# Altium schematic sheet MARS_FTDI.SchDoc: My title
size A3; Organization: University of California; Address1: 475 Portola Plaza; Address2: Los Angeles, CA 90095; Revision: R01; SheetNumber: 1; SheetTotal: 1
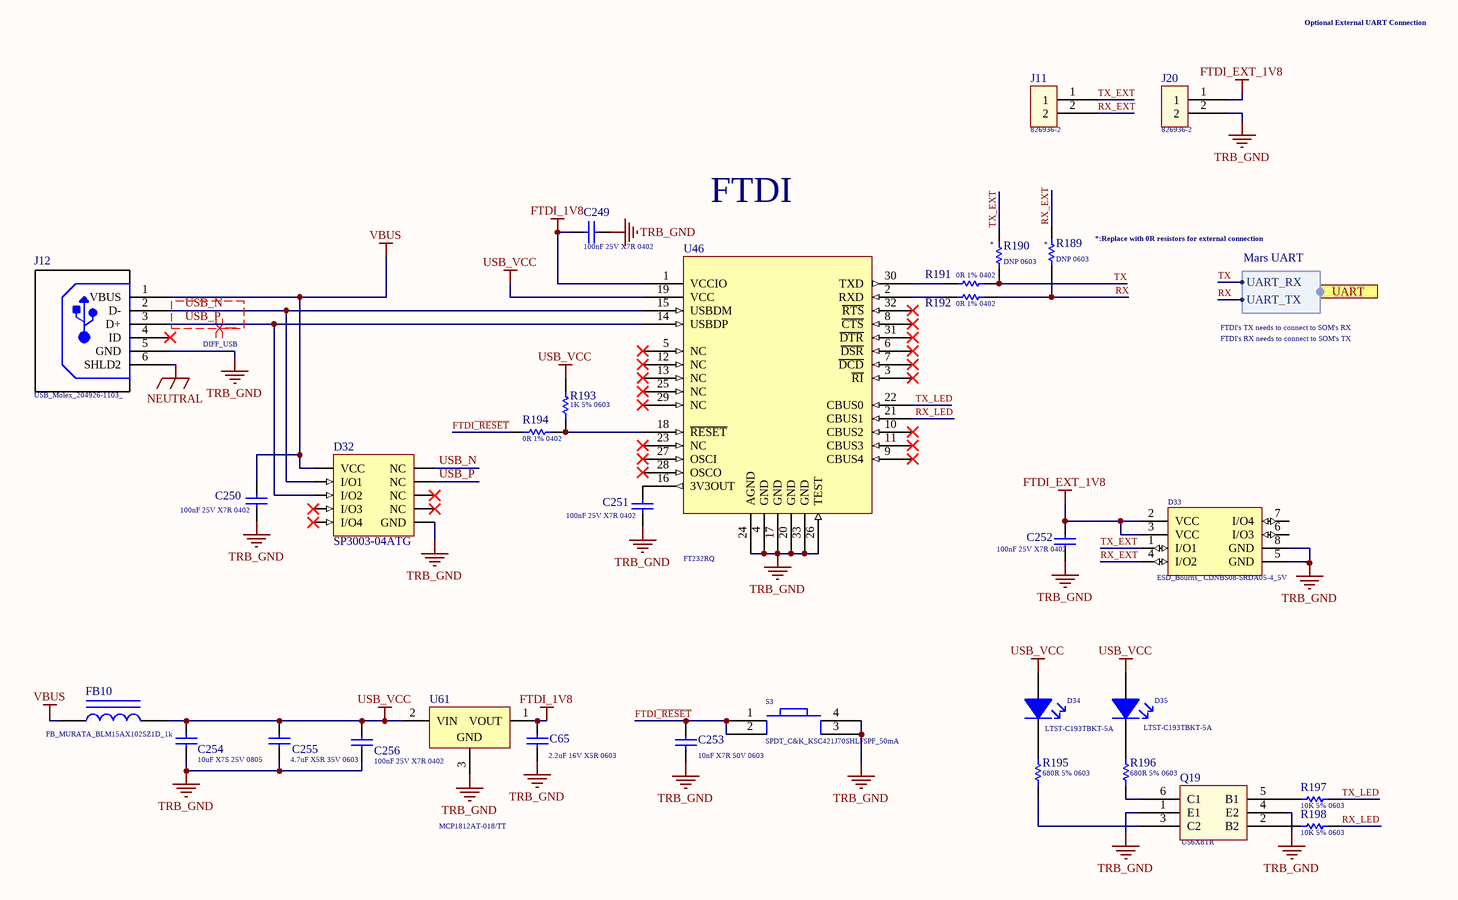
[diagram p0: MARS_FTDI.SchDoc]

## Parts
C65  Capacitance: 2.2uF 16V X5R 0603  [CAPC0603(1608)100_L]  (hidden comment: Cap_Taiyo_Yuden_2.2uF)
C249  Capacitance: 100nF 25V X7R 0402  [Cap_Taiyo_Yuden_TMK105B7104KV-FR_100nF]  (hidden comment: Cap_Taiyo_Yuden_TMK105B7104KV-FR_100nF)
C250  Capacitance: 100nF 25V X7R 0402  [Cap_Taiyo_Yuden_TMK105B7104KV-FR_100nF]  (hidden comment: Cap_Taiyo_Yuden_TMK105B7104KV-FR_100nF)
C251  Capacitance: 100nF 25V X7R 0402  [Cap_Taiyo_Yuden_TMK105B7104KV-FR_100nF]  (hidden comment: Cap_Taiyo_Yuden_TMK105B7104KV-FR_100nF)
C252  Capacitance: 100nF 25V X7R 0402  [Cap_Taiyo_Yuden_TMK105B7104KV-FR_100nF]  (hidden comment: Cap_Taiyo_Yuden_TMK105B7104KV-FR_100nF)
C253  Capacitance: 10nF X7R 50V 0603  [Kemet_C0603_0]  (hidden comment: Cap_Kemet_C0603C103J5RACTU_eec)
C254  Capacitance: 10uF X7S 25V 0805  [Cap_Murata_ GRM21BC71E106ME11L_10uF]  (hidden comment: Cap_Murata_ GRM21BC71E106ME11L_10uF)
C255  Capacitance: 4.7uF X5R 35V 0603  [Cap_Murata_ZRB18AR6YA475ME05L_4.7uF]  (hidden comment: Cap_Murata_ZRB18AR6YA475ME05L_4.7uF)
C256  Capacitance: 100nF 25V X7R 0402  [Cap_Taiyo_Yuden_TMK105B7104KV-FR_100nF]  (hidden comment: Cap_Taiyo_Yuden_TMK105B7104KV-FR_100nF)
D32  Series: SP3003-04ATG  [Diode_SP3003-04ATG_LVDS_ESD]  (hidden comment: Diode_SP3003-04ATG_LVDS_ESD)
D33  ESD_Bourns_ CDNBS08-SRDA05-4_5V  [ESD_Bourns_ CDNBS08-SRDA05-4_5V]
D34  Series: LTST-C193TBKT-5A  [Led_Lite-On_LTST-C193TBKT-5A_Blue]  (hidden comment: Led_Lite-On_LTST-C193TBKT-5A_Blue)
D35  Series: LTST-C193TBKT-5A  [Led_Lite-On_LTST-C193TBKT-5A_Blue]  (hidden comment: Led_Lite-On_LTST-C193TBKT-5A_Blue)
FB10  FB_MURATA_BLM15AX102SZ1D_1k  [FB_MURATA_BLM15AX102SZ1D_1k]
J11  Series: 826936-2  [Header_TE_Connectivity_826936-2_2POS_5A]  (hidden comment: Header_TE_Connectivity_826936-2_2POS_5A)
J12  USB_Molex_204926-1103_  [USB_Molex_204926-1103]
J20  Series: 826936-2  [Header_TE_Connectivity_826936-2_2POS_5A]  (hidden comment: Header_TE_Connectivity_826936-2_2POS_5A)
Q19  Series: US6X8TR  [BJT_ROHM_US6X8TR_1A_NPN]  (hidden comment: BJT_ROHM_US6X8TR_1A_NPN)
R189  Resistance: DNP 0603  [RES_DNP_0603]  (hidden comment: RES_DNP_0603)
R190  Resistance: DNP 0603  [RES_DNP_0603]  (hidden comment: RES_DNP_0603)
R191  Resistance: 0R 1% 0402  [Res_Vishay_CRCW04020000Z0EDC_0_Ohm]  (hidden comment: Res_Vishay_CRCW04020000Z0EDC_0_Ohm)
R192  Resistance: 0R 1% 0402  [Res_Vishay_CRCW04020000Z0EDC_0_Ohm]  (hidden comment: Res_Vishay_CRCW04020000Z0EDC_0_Ohm)
R193  1K 5% 0603  [RESC0603(1608)_L]
R194  Resistance: 0R 1% 0402  [Res_Vishay_CRCW04020000Z0EDC_0_Ohm]  (hidden comment: Res_Vishay_CRCW04020000Z0EDC_0_Ohm)
R195  680R 5% 0603  [RESC0603(1608)_L]
R196  680R 5% 0603  [RESC0603(1608)_L]
R197  10K 5% 0603  [RESC0603(1608)_L]
R198  10K 5% 0603  [RESC0603(1608)_L]
S3  SPDT_C&K_KSC421J70SHLFSPF_50mA  [SPDT_C&K_KSC421J70SHLFSPF_50mA]
U46  Series: FT232RQ  [IC_FTDI_FT232RQ-REEL]  (hidden comment: IC_FTDI_FT232RQ-REEL)
U61  Series: MCP1812AT-018/TT  [LDO_Microchip_MCP1812AT-018_1V8]  (hidden comment: LDO_Microchip_MCP1812AT-018_1V8)

## Ports
UART (harness Mars UART)

## Harnesses
Mars UART: UART_RX, UART_TX

## Nets
FTDI_1V8: C65.2 C249.2 U46.1(VCCIO) U61.1(VOUT)
FTDI_EXT_1V8: C252.2 D33.2(VCC) D33.3(VCC) J20.1
NEUTRAL: J12.6(SHLD2)
TRB_GND: C65.1 C249.1 C250.1 C251.1 C252.1 C253.2 C254.2 C255.1 C256.1 D32.8(GND) D33.5(GND) D33.8(GND) J12.5(GND) J20.2 Q19.1(E1) Q19.4(E2) S3.3 S3.4 U46.4(GND) U46.17(GND) U46.20(GND) U46.24(AGND) U46.26(TEST) U46.33(GND) U61.3(GND)
USB_VCC: C254.1 C255.2 C256.2 D34.2(A) D35.2(A) FB10.2 R193.2 U46.19(VCC) U61.2(VIN)
VBUS: C250.2 D32.3(VCC) FB10.1 J12.1(VBUS)
FTDI~{_RESET}: C253.1 R194.2 S3.1 S3.2
RX: R189.2 R192.2 ; port UART.UART_TX
RX_EXT: D33.4(I/O2) J11.2 R189.1
RX_LED: R198.1 U46.21(CBUS1)
TX: R190.2 R191.2 ; port UART.UART_RX
TX_EXT: D33.1(I/O1) J11.1 R190.1
TX_LED: R197.2 U46.22(CBUS0)
USB_N: D32.1(I/O1) D32.10(NC) J12.2(D-) U46.15(USBDM)
USB_P: D32.2(I/O2) D32.9(NC) J12.3(D+) U46.14(USBDP)
NetC251_2: C251.2 U46.16(3V3OUT)
NetD34_1: D34.1(K) R195.2
NetD35_1: D35.1(K) R196.2
NetQ19_2: Q19.2(B2) R198.2
NetQ19_3: Q19.3(C2) R195.1
NetQ19_5: Q19.5(B1) R197.1
NetQ19_6: Q19.6(C1) R196.1
NetR191_1: R191.1 U46.30(TXD)
NetR192_1: R192.1 U46.2(RXD)
NetR193_1: R193.1 R194.1 U46.18(~{RESET})

Not connected (* = marked no-connect by the designer): D32 4(I/O3)* 5(I/O4)* 6(NC)* 7(NC)*; D33 6(I/O3) 7(I/O4); J12 4(ID)*; U46 3(~{RI})* 5(NC)* 6(~{DSR})* 7(~{DCD})* 8(~{CTS})* 9(CBUS4)* 10(CBUS2)* 11(CBUS3)* 12(NC)* 13(NC)* 23(NC)* 25(NC)* 27(OSCI)* 28(OSCO)* 29(NC)* 31(~{DTR})* 32(~{RTS})*

## Layout directives
differential pair; differential pair class DIFF_USB: USB_N, USB_P

## Notes on the sheet
- Optional External UART Connection
- FTDI
- (near R190) *
- (near R189) *
- (near R189) *:Replace with 0R resistors for external connection
- FTDI's TX needs to connect to SOM's RX
- FTDI's RX needs to connect to SOM's TX
- 475 Portola Plaza
- GAPS TOF
- igarcia91@g.ucla.edu
- Los Angeles, CA
- 310-825-0344
- Size:
- Date:
- Letter
- Number:
- Time:
- Sheet
- Revision:
- of
- andrew.peck@cern.ch
- spq@ucla.edu
- File:

## Library data of the parts
C65 = CMP-1035-02763-1: CAP 2.2uF 16V ±10% 0603 (1608 Metric) Thickness 1mm SMD; Case-Metric: 1608; Case-EIA: 0603; Tolerance: Â±10%; Value: 2.2uF; Max Thickness: 1 mm; Technology: SMT; Rated Voltage: 16 V; Parameter 1: *
C249-C252 C256 = Cap_Taiyo_Yuden_TMK105B7104KV-FR_100nF: CAP CER 100nF 25V X7R 0402; Supplier 1: Mouser; Supplier Part Number 1: 963-TMK105B7104KV-FR
C253 = Cap_Kemet_C0603C103J5RACTU_eec: CAP CER 10nF 50V X7R 0603; Manufacturer: Kemet; Mfg Package Ident: C0603; Part Number: C0603C103J5RACTU; helpURL: https://upverter.com/upn/revision/8a8d0c297e33ac74/; ComponentLink2Description: Datasheet; Temperature: -55°C to +125°C; Package: C0603; Supplier 2: Mouser; Price: 0.0184203126773; Supplier 1: Digi-Key; ComponentLink1URL: https://upverter.com/upn/revision/8a8d0c297e33ac74/; Supplier Part Number 2: 80-C0603C103J5R; Supplier Part Number 1: 399-1092-1-ND; Value: 10nF; ComponentLink1Description: Upverter; ComponentLink2URL: https://content.kemet.com/datasheets/KEM_C1002_X7R_SMD.pdf; RoHS: TRUE; Mouser Part Number: 80-C0603C103J5R; Temperature Range High: +125°C; Digikey Description: CAP CER 10000PF 50V X7R 0603; Digikey Part Number: 399-1092-1-ND; Lead Free: yes; Temperature Range Low: -55°C; Voltage: 50V
C254 = Cap_Murata_ GRM21BC71E106ME11L_10uF: CAP CER 10uF 25V X7R 0805; Supplier 1: Mouser; Supplier Part Number 1: 81-GRM21BC71E106ME1L
C255 = Cap_Murata_ZRB18AR6YA475ME05L_4.7uF: CAP CER 4.7uF 35V X5R 0603; Supplier 1: Mouser; Supplier Part Number 1: 81-ZRB18AR6YA475ME5L
D32 = Diode_SP3003-04ATG_LVDS_ESD: ESD Suppressors / TVS Diodes 4 Ch 8kV 0.65pF SPA; Supplier 1: Mouser; Supplier Part Number 1: 576-SP3003-04ATG
D33 = ESD_Bourns_ CDNBS08-SRDA05-4_5V: ESD Suppressors / TVS Diodes SO-8 5V 500W Low Capacitance; Supplier Part Number 1: 652-CDNBS08-SRDA05-4; Supplier 1: Mouser
D34 D35 = Led_Lite-On_LTST-C193TBKT-5A_Blue: Standard LEDs - SMD Blue 470nm 28mcd 20mA; Supplier 1: Mouser; Supplier Part Number 1: 859-LTSTC193TBKT5A
FB10 = FB_MURATA_BLM15AX102SZ1D_1k: FB SMD 1000 OHM 25% 3/4W 0402; Supplier Part Number 1: 81-BLM15AX102SZ1D; Supplier 1: Mouser
J11 J20 = Header_TE_Connectivity_826936-2_2POS_5A: Headers & Wire Housings 2P SINGLE ROW 5A; Supplier Part Number 1: 571-826936-2; Supplier 1: Mouser
J12 = USB_Molex_204926-1103: USB Connectors MicroUSB B Rec SMT WOut Flange WtrProf; Series: 204926-1103; Supplier Part Number 1: 538-204926-1103; Supplier 1: Mouser
Q19 = BJT_ROHM_US6X8TR_1A_NPN: Bipolar Transistors - BJT NPN+NPN 30VCEO 1A SOT-363T; Supplier Part Number 1: 755-US6X8TR; Supplier 1: Mouser
R189 R190 = RES_DNP_0603: 0603 Do not place resistor
R191 R192 R194 = Res_Vishay_CRCW04020000Z0EDC_0_Ohm: 0R 0.062W 1% 0402 (1005 Metric)  SMD; Supplier 1: Mouser; Supplier Part Number 1: 71-CRCW04020000Z0EDC
R193 = CMP-1012-00074-1: 1K 0.1W 5% 0603 (1608 Metric)  SMD; Case-EIA: 0603; Case-Metric: 1608; Value: 1000.00 Ohm; Technology: SMT; Tolerance: 5 %; Power: 0.1 W
R195 R196 = CMP-1012-00070-1: 680R 0.1W 5% 0603 (1608 Metric)  SMD; Case-EIA: 0603; Value: 680.00 Ohm; Case-Metric: 1608; Tolerance: 5 %; Technology: SMT; Power: 0.1 W
R197 R198 = CMP-1012-00098-1: 10K 0.1W 5% 0603 (1608 Metric)  SMD; Case-EIA: 0603; Value: 10000.00 Ohm; Case-Metric: 1608; Technology: SMT; Tolerance: 5 %; Power: 0.1 W
S3 = SPDT_C&K_KSC421J70SHLFSPF_50mA: Tactile Switches Tact 6.2 x 6.2, 5.1 mm H, 1.7N, J leads, Potting Friendly, IP67; Supplier 1: Mouser; Supplier Part Number 1: 611-KSC421J70SHLFSPF
U46 = IC_FTDI_FT232RQ-REEL: USB Interface IC USB to Serial UART Enhanced IC QFN-32; Supplier 1: Mouser; Supplier Part Number 1: 895-FT232RQ
U61 = LDO_Microchip_MCP1812AT-018_1V8: LDO Voltage Regulators Ultra Low Iq LDO; Supplier 1: Mouser; Supplier Part Number 1: 579-MCP1812AT-018/TT